# Altium schematic sheet TopLevel.SchDoc
size A; SheetNumber: 1; SheetTotal: 2
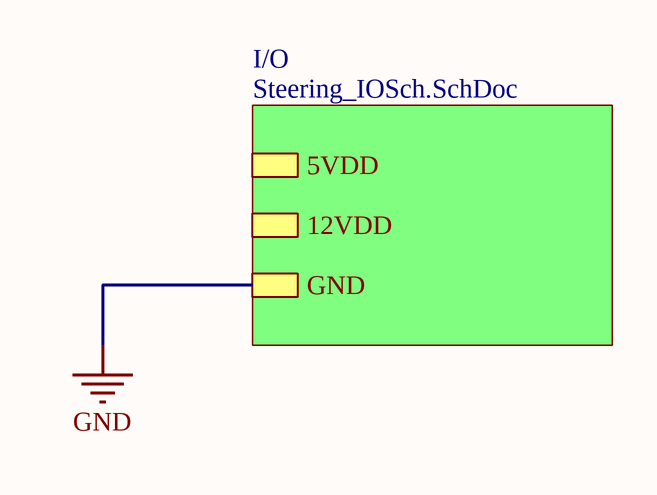
[diagram p0: TopLevel.SchDoc]

## Sub-sheets
I/O = Steering_IOSch.SchDoc: 5VDD, 12VDD, GND

## Nets
GND: sheet I/O/GND